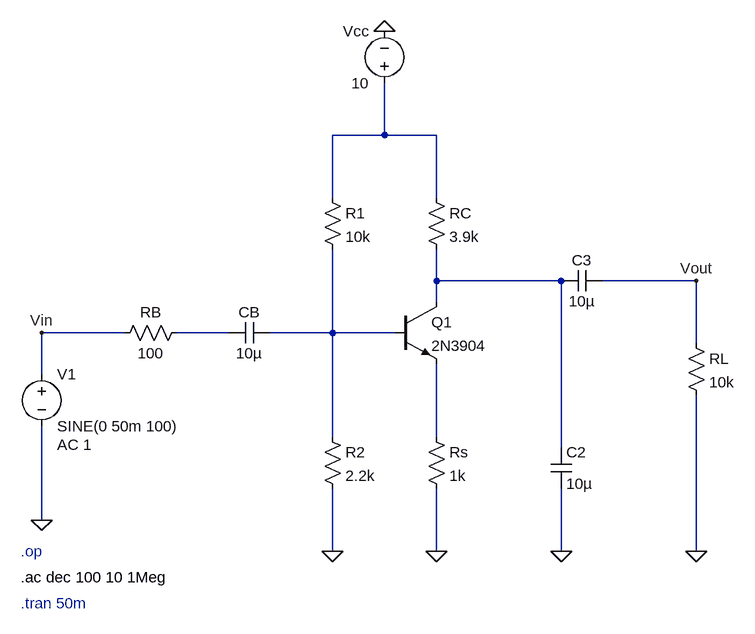
[diagram p0: schematic CEAmplifier.asc]
CEAmplifier.asc, the LTspice schematic file:
Version 4.1
SHEET 1 1140 680
WIRE 592 -208 592 -288
WIRE 592 -208 512 -208
WIRE 672 -208 592 -208
WIRE 512 -112 512 -208
WIRE 672 -112 672 -208
WIRE 672 16 672 -32
WIRE 864 16 672 16
WIRE 1072 16 928 16
WIRE 672 48 672 16
WIRE 192 96 64 96
WIRE 352 96 272 96
WIRE 512 96 512 -32
WIRE 512 96 416 96
WIRE 608 96 512 96
WIRE 1072 112 1072 16
WIRE 64 160 64 96
WIRE 512 256 512 96
WIRE 672 256 672 144
WIRE 864 272 864 16
WIRE 64 384 64 240
WIRE 512 432 512 336
WIRE 672 432 672 336
WIRE 864 432 864 336
WIRE 1072 432 1072 192
FLAG 64 384 0
FLAG 512 432 0
FLAG 672 432 0
FLAG 864 432 0
FLAG 1072 432 0
FLAG 592 -368 0
FLAG 64 96 Vin
FLAG 1072 16 Vout
SYMBOL voltage 64 144 R0
WINDOW 123 24 124 Left 2
WINDOW 39 0 0 Left 0
SYMATTR Value2 AC 1
SYMATTR InstName V1
SYMATTR Value SINE(0 50m 100)
SYMBOL res 176 112 R270
WINDOW 0 32 56 VTop 2
WINDOW 3 0 56 VBottom 2
SYMATTR InstName RB
SYMATTR Value 100
SYMBOL cap 416 80 R90
WINDOW 0 0 32 VBottom 2
WINDOW 3 32 32 VTop 2
SYMATTR InstName CB
SYMATTR Value 10µ
SYMBOL res 496 -128 R0
SYMATTR InstName R1
SYMATTR Value 10k
SYMBOL res 656 -128 R0
SYMATTR InstName RC
SYMATTR Value 3.9k
SYMBOL res 496 240 R0
SYMATTR InstName R2
SYMATTR Value 2.2k
SYMBOL res 656 240 R0
SYMATTR InstName Rs
SYMATTR Value 1k
SYMBOL cap 848 272 R0
SYMATTR InstName C2
SYMATTR Value 10µ
SYMBOL cap 928 0 R90
WINDOW 0 0 32 VBottom 2
WINDOW 3 32 32 VTop 2
SYMATTR InstName C3
SYMATTR Value 10µ
SYMBOL res 1056 96 R0
SYMATTR InstName RL
SYMATTR Value 10k
SYMBOL npn 608 48 R0
SYMATTR InstName Q1
SYMATTR Value 2N3904
SYMBOL voltage 592 -272 R180
WINDOW 0 24 96 Left 2
WINDOW 3 24 16 Left 2
SYMATTR InstName Vcc
SYMATTR Value 10
TEXT 32 512 Left 2 ;.tran 50m
TEXT 32 432 Left 2 ;.op
TEXT 32 472 Left 2 !.ac dec 100 10 1Meg

The netlist it stands for:
* CEAmplifier.asc
V1 Vin 0 SINE(0 50m 100) AC 1
RB Vin N003 100
CB N004 N003 10µ
R1 N001 N004 10k
RC N001 N002 3.9k
R2 N004 0 2.2k
Rs N005 0 1k
C2 N002 0 10µ
C3 Vout N002 10µ
RL Vout 0 10k
Q1 N002 N004 N005 0 2N3904
Vcc N001 0 10
.model NPN NPN
.model PNP PNP
.lib standard.bjt
* .tran 50m
* .op
.ac dec 100 10 1Meg
.backanno
.end